# Altium schematic sheet TherrmistorMux.SchDoc: ThermistorMux
size 431 x 279 mm; Engineer: Jim MacArthur; Revision: 00; SheetNumber: 1; SheetTotal: 1; DocumentName: Sheet1.SCHDOC
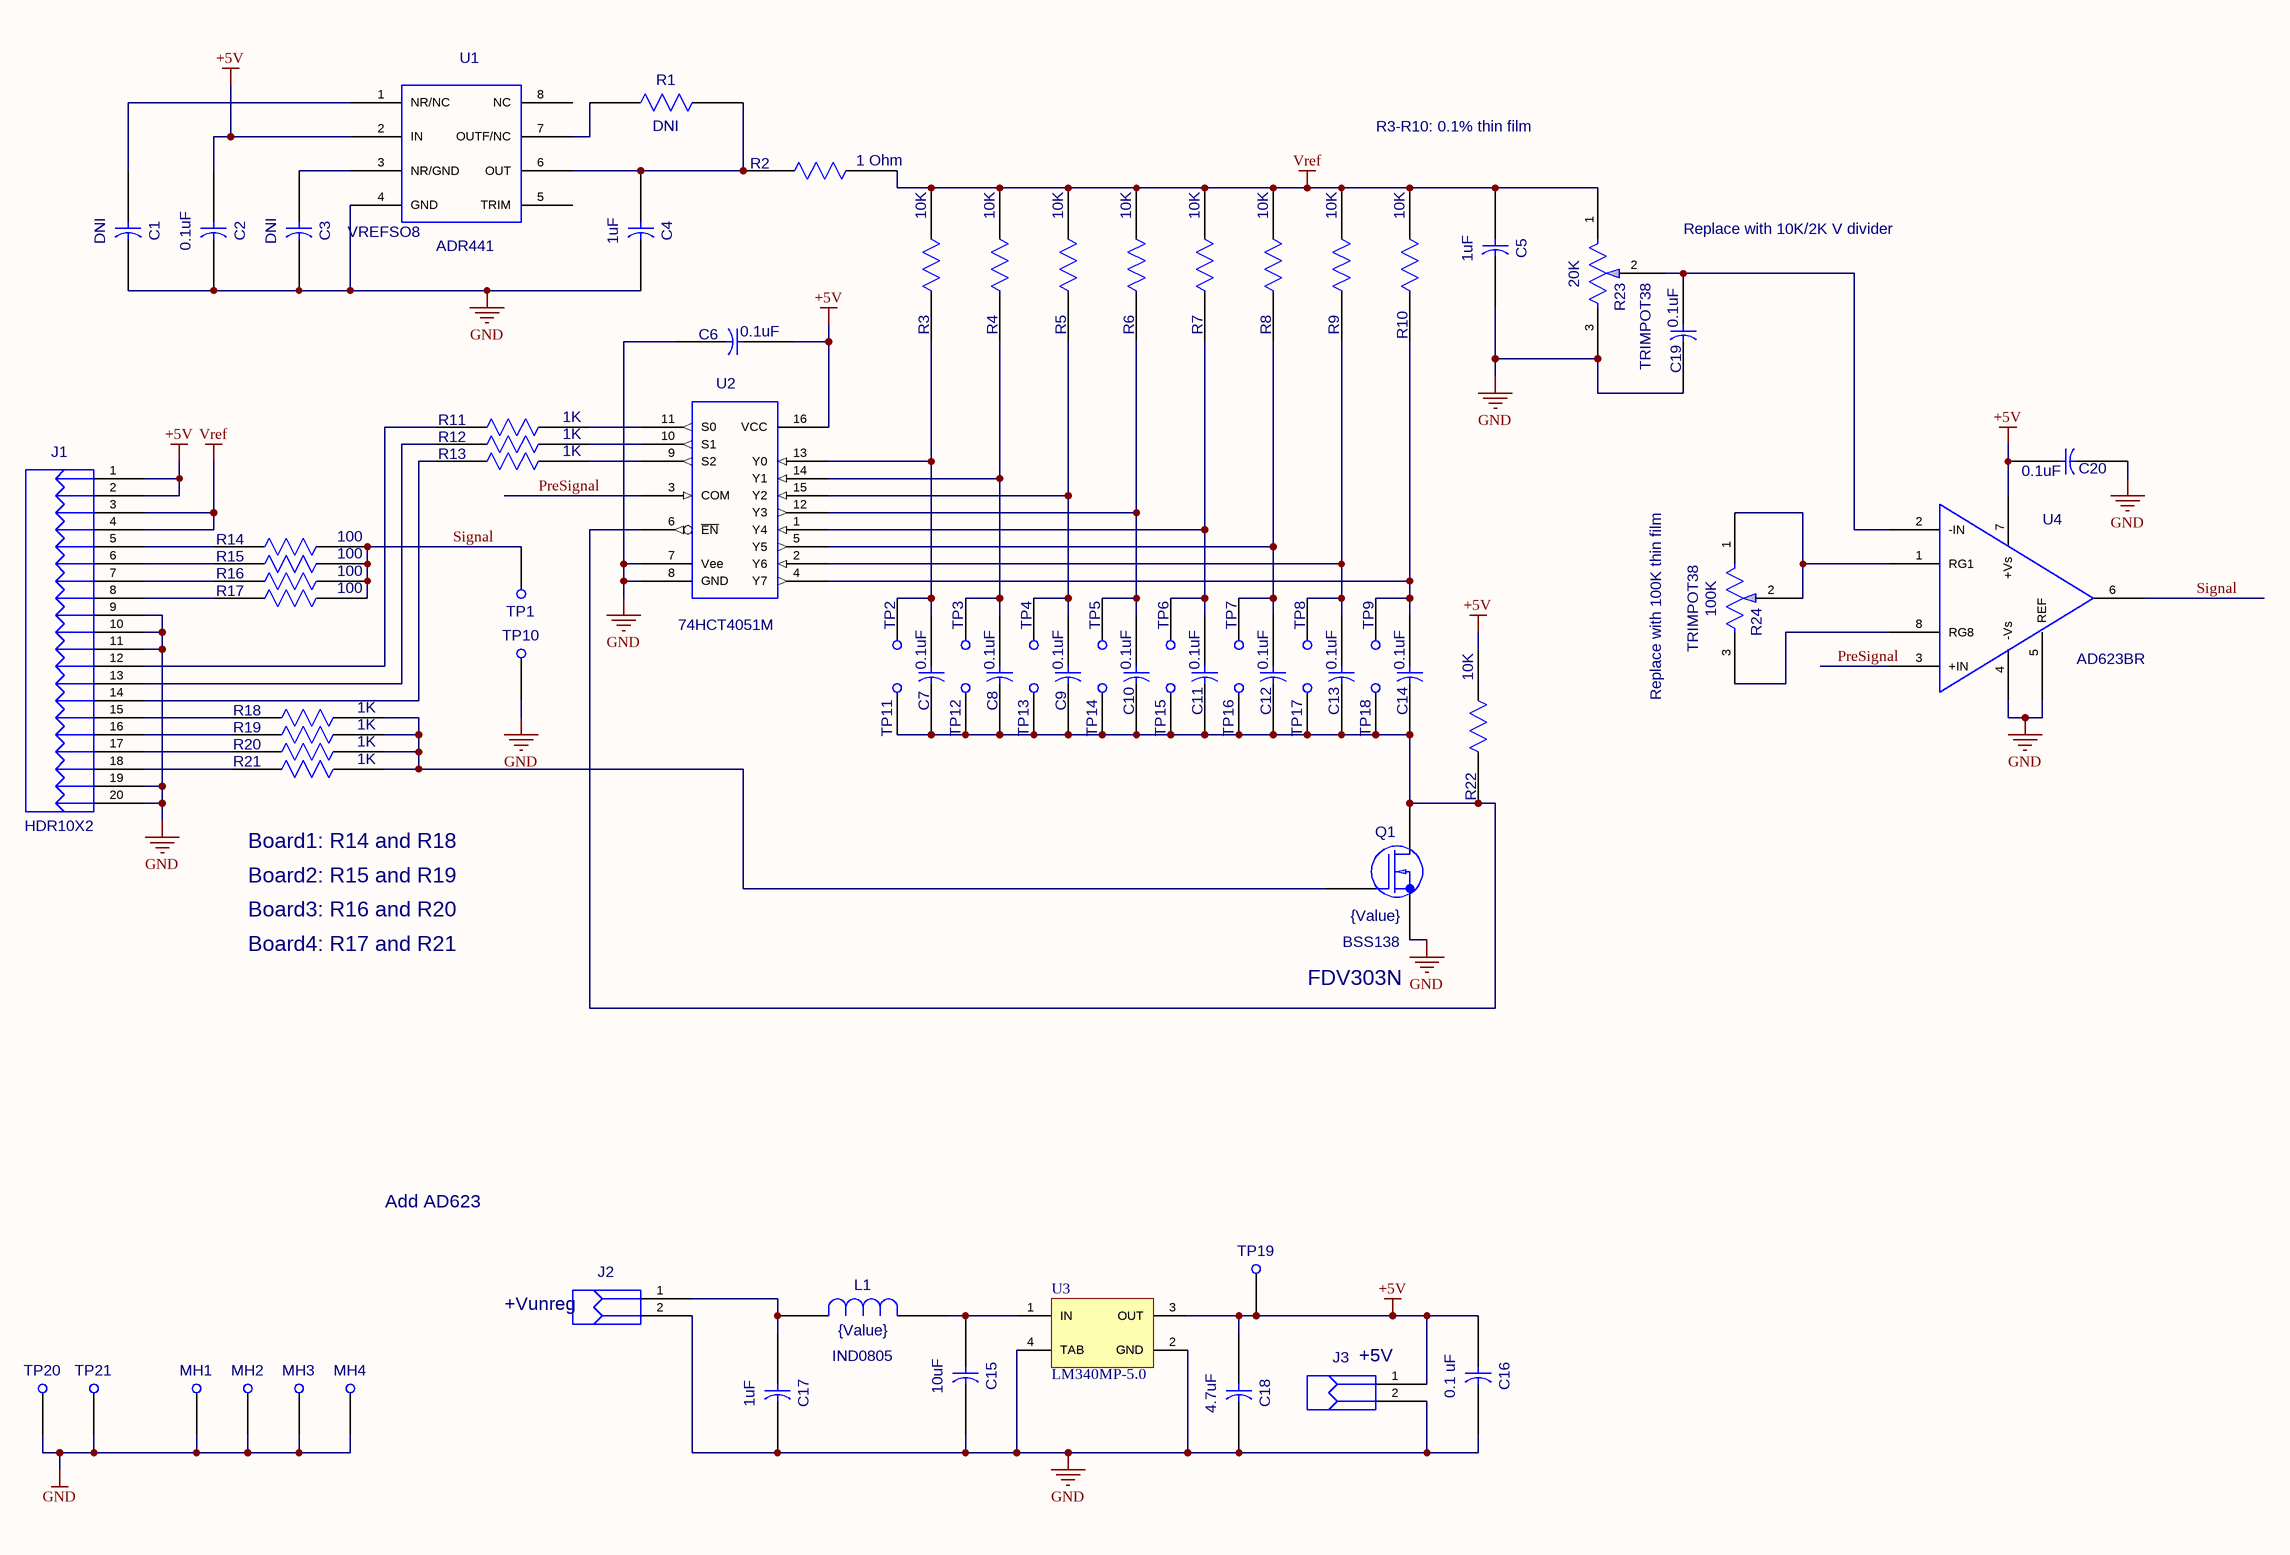
[diagram p0: TherrmistorMux.SchDoc]

## Parts
C1  value DNI  [RC0603]  (hidden comment: CAP0603)
C2  value 0.1uF  [RC0603]  (hidden comment: CAP0603)
C3  value DNI  [RC0603]  (hidden comment: CAP0603)
C4  value 1uF  [RC0805_CAP0805(Primary)]  (hidden comment: CAP0805)
C5  value 1uF  [RC0805_CAP0805(Primary)]  (hidden comment: CAP0805)
C6  value 0.1uF  [RC0603]  (hidden comment: CAP0603)
C7  value 0.1uF  [RC0805_CAP0805(Primary)]  (hidden comment: CAP0805)
C8  value 0.1uF  [RC0805_CAP0805(Primary)]  (hidden comment: CAP0805)
C9  value 0.1uF  [RC0805_CAP0805(Primary)]  (hidden comment: CAP0805)
C10  value 0.1uF  [RC0805_CAP0805(Primary)]  (hidden comment: CAP0805)
C11  value 0.1uF  [RC0805_CAP0805(Primary)]  (hidden comment: CAP0805)
C12  value 0.1uF  [RC0805_CAP0805(Primary)]  (hidden comment: CAP0805)
C13  value 0.1uF  [RC0805_CAP0805(Primary)]  (hidden comment: CAP0805)
C14  value 0.1uF  [RC0805_CAP0805(Primary)]  (hidden comment: CAP0805)
C15  value 10uF  [RC1206_CAP1206(Primary)]  (hidden comment: CAP1206)
C16  value 0.1 uF  [RC0805_CAP0805(Primary)]  (hidden comment: CAP0805)
C17  value 1uF  [RC1206_CAP1206(Primary)]  (hidden comment: CAP1206)
C18  value 4.7uF  [RC1206_CAP1206(Primary)]  (hidden comment: CAP1206)
C19  value 0.1uF  [RC0603]  (hidden comment: CAP0603)
C20  value 0.1uF  [RC0603]  (hidden comment: CAP0603)
J1  HDR10X2  [HDR10X2]
J2  CONN2P35MM  [CONN2P35MM]  (value not drawn)
J3  CONN2P35MM  [CONN2P35MM]  (value not drawn)
L1  IND0805  value {Value}  [RC0805_IND0805(Primary)]
MH1  MH440  [M440_MH440()]  (value not drawn)
MH2  MH440  [M440_MH440()]  (value not drawn)
MH3  MH440  [M440_MH440()]  (value not drawn)
MH4  MH440  [M440_MH440()]  (value not drawn)
Q1  BSS138  value {Value}  [SOT-23]
R1  value DNI  [RC0603]  (hidden comment: RES0603)
R2  value 1 Ohm  [RC0805_RES0805(Primary)]  (hidden comment: RES0805)
R3  value 10K  [RC0805_RES0805(Primary)]  (hidden comment: RES0805)
R4  value 10K  [RC0805_RES0805(Primary)]  (hidden comment: RES0805)
R5  value 10K  [RC0805_RES0805(Primary)]  (hidden comment: RES0805)
R6  value 10K  [RC0805_RES0805(Primary)]  (hidden comment: RES0805)
R7  value 10K  [RC0805_RES0805(Primary)]  (hidden comment: RES0805)
R8  value 10K  [RC0805_RES0805(Primary)]  (hidden comment: RES0805)
R9  value 10K  [RC0805_RES0805(Primary)]  (hidden comment: RES0805)
R10  value 10K  [RC0805_RES0805(Primary)]  (hidden comment: RES0805)
R11  value 1K  [RC0805_RES0805(Primary)]  (hidden comment: RES0805)
R12  value 1K  [RC0805_RES0805(Primary)]  (hidden comment: RES0805)
R13  value 1K  [RC0805_RES0805(Primary)]  (hidden comment: RES0805)
R14  value 100  [RC0805_RES0805(Primary)]  (hidden comment: RES0805)
R15  value 100  [RC0805_RES0805(Primary)]  (hidden comment: RES0805)
R16  value 100  [RC0805_RES0805(Primary)]  (hidden comment: RES0805)
R17  value 100  [RC0805_RES0805(Primary)]  (hidden comment: RES0805)
R18  value 1K  [RC0805_RES0805(Primary)]  (hidden comment: RES0805)
R19  value 1K  [RC0805_RES0805(Primary)]  (hidden comment: RES0805)
R20  value 1K  [RC0805_RES0805(Primary)]  (hidden comment: RES0805)
R21  value 1K  [RC0805_RES0805(Primary)]  (hidden comment: RES0805)
R22  value 10K  [RC0805_RES0805(Primary)]  (hidden comment: RES0805)
R23  TRIMPOT38  value 20K  [TRIM38]
R24  TRIMPOT38  value 100K  [TRIM38]
TP1  TP38  [TP38]  (value not drawn)
TP2  TP24  [TP24]  (value not drawn)
TP3  TP24  [TP24]  (value not drawn)
TP4  TP24  [TP24]  (value not drawn)
TP5  TP24  [TP24]  (value not drawn)
TP6  TP24  [TP24]  (value not drawn)
TP7  TP24  [TP24]  (value not drawn)
TP8  TP24  [TP24]  (value not drawn)
TP9  TP24  [TP24]  (value not drawn)
TP10  TP38  [TP38]  (value not drawn)
TP11  TP24  [TP24]  (value not drawn)
TP12  TP24  [TP24]  (value not drawn)
TP13  TP24  [TP24]  (value not drawn)
TP14  TP24  [TP24]  (value not drawn)
TP15  TP24  [TP24]  (value not drawn)
TP16  TP24  [TP24]  (value not drawn)
TP17  TP24  [TP24]  (value not drawn)
TP18  TP24  [TP24]  (value not drawn)
TP19  TP52  [TP52]  (value not drawn)
TP20  TP52  [TP52]  (value not drawn)
TP21  TP52  [TP52]  (value not drawn)
U1  VREFSO8  value ADR441  [SO8]
U2  74HCT4051M  [SO16]
U3  LM340MP-5.0  [MP04A_N]
U4  AD623BR  [SO8]

## Nets
+5V: C2.2 C6.2 C16.A C18.A C20.2 J1.1(P1) J1.2(P2) J3.1 R22.B TP19.1 U1.2(IN) U2.16(VCC) U3.3(OUT) U4.7(+Vs)
GND: C1.1 C2.1 C3.1 C4.B C5.B C6.1 C15.B C16.B C17.B C18.B C19.1 C20.1 J1.9(P9) J1.10(P10) J1.11(P11) J1.19(P19) J1.20(P20) J2.2 J3.2 MH1.1 MH2.1 MH3.1 MH4.1 Q1.2(S) R23.3 TP10.1 TP20.1 TP21.1 U1.4(GND) U2.7(Vee) U2.8(GND) U3.2(GND) U3.4(TAB) U4.4(-Vs) U4.5(REF)
Vref: C5.A J1.3(P3) J1.4(P4) R2.B R3.B R4.B R5.B R6.B R7.B R8.B R9.B R10.B R23.1
PreSignal: U2.3(COM) U4.3(+IN)
Signal: R14.B R15.B R16.B R17.B TP1.1 U4.6(OUT)
NetC1_2: C1.2 U1.1(NR/NC)
NetC3_2: C3.2 U1.3(NR/GND)
NetC4_A: C4.A R1.1(A) R2.A U1.6(OUT)
NetC7_A: C7.A R3.A TP2.1 U2.13(Y0)
NetC7_B: C7.B C8.B C9.B C10.B C11.B C12.B C13.B C14.B Q1.3(D) R22.A TP11.1 TP12.1 TP13.1 TP14.1 TP15.1 TP16.1 TP17.1 TP18.1 U2.6(~{EN})
NetC8_A: C8.A R4.A TP3.1 U2.14(Y1)
NetC9_A: C9.A R5.A TP4.1 U2.15(Y2)
NetC10_A: C10.A R6.A TP5.1 U2.12(Y3)
NetC11_A: C11.A R7.A TP6.1 U2.1(Y4)
NetC12_A: C12.A R8.A TP7.1 U2.5(Y5)
NetC13_A: C13.A R9.A TP8.1 U2.2(Y6)
NetC14_A: C14.A R10.A TP9.1 U2.4(Y7)
NetC15_A: C15.A L1.A U3.1(IN)
NetC17_A: C17.A J2.1 L1.B
NetC19_2: C19.2 R23.2 U4.2(-IN)
NetJ1_5: J1.5(P5) R14.A
NetJ1_6: J1.6(P6) R15.A
NetJ1_7: J1.7(P7) R16.A
NetJ1_8: J1.8(P8) R17.A
NetJ1_12: J1.12(P12) R11.A
NetJ1_13: J1.13(P13) R12.A
NetJ1_14: J1.14(P14) R13.A
NetJ1_15: J1.15(P15) R18.A
NetJ1_16: J1.16(P16) R19.A
NetJ1_17: J1.17(P17) R20.A
NetJ1_18: J1.18(P18) R21.A
NetQ1_1: Q1.1(G) R18.B R19.B R20.B R21.B
NetR1_2: R1.2(B) U1.7(OUTF/NC)
NetR11_B: R11.B U2.11(S0)
NetR12_B: R12.B U2.10(S1)
NetR13_B: R13.B U2.9(S2)
NetR24_1: R24.1 R24.2 U4.1(RG1)
NetR24_3: R24.3 U4.8(RG8)

Not connected (* = marked no-connect by the designer): U1 5(TRIM) 8(NC)

## Notes on the sheet
- R3-R10: 0.1% thin film
- Replace with 10K/2K V divider
- Replace with 100K thin film
- Board1: R14 and R18
- Board2: R15 and R19
- Board3: R16 and R20
- Board4: R17 and R21
- FDV303N
- Add AD623
- +Vunreg
- (near J3) +5V
- A
- B
- C
- D
- 1
- 2
- 3
- 4
- Title
- Size
- Number
- Rev
- Date
- Filename
- Drawn by
- Sheet
- of

## Library data of the parts
U3 = LM340MP-5.0: Series 3-Terminal Positive Regulators; Manufacturer: National Semiconductor; CompType: LDO IC; PackageTopMarking: XYTT*N00A; PowerWise: N; Published: 4-Dec-2008; DatasheetVersion: Jul-2006; PackageVersion: revB, Apr-2003; PackageReference: MP04A; Publisher: Altium Limited; PackageDescription: Molded SOT-223, 6.50 x 3.56 x 1.6mm Body, 4 Lead, 2.3mm Pitch; PartNumber: LM340MP-5.0; RoHS: O; PinCount: 4; DigiKeyPartNumber: LM340MP-5.0CT-ND; Code_JEDEC: TO-261-AA; Code_IPC: SOT223-4; ComponentLink1Description: LM340 Datasheet; ComponentLink1URL: http://www.national.com/ds/LM/LM340.pdf; ComponentLink2Description: LM340 Web Page; ComponentLink2URL: http://www.national.com/pf/LM/LM340.html; ComponentLink3Description: MP04A Package Page; ComponentLink3URL: http://www.national.com/packaging/folders/mp04a.html
U4 = AD620BR: Value: *
J1 = HDR10X2: Value: *
J2 J3 = CONN2P35MM: Value: *
TP1 TP10 = TP38: Value: *
TP2-TP9 TP11-TP18 = TP24: Value: *
TP19-TP21 = TP52: Value: *
U2 = 74HCT4051M: Value: *